# Altium schematic sheet Wombat.SchDoc
size A4; SheetNumber: 1; SheetTotal: 1
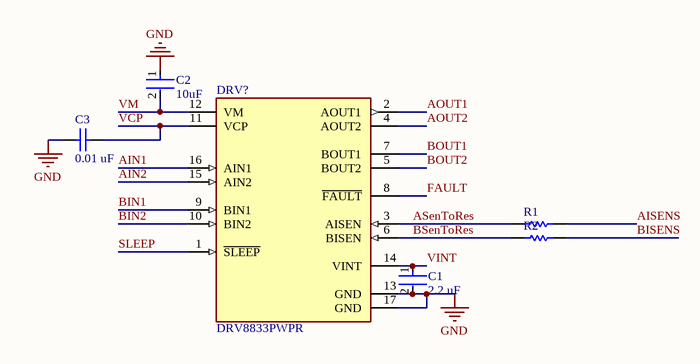
[diagram p0: Wombat.SchDoc]

## Parts
C1  2.2 uF  [FP-GRM188-0_1-e0_2_0_5-MFG]
C2  10uF  [FP-GRM188-0_1-e0_2_0_55-IPC_A]
C3  0.01 uF  [CAPC1608X90X35ML10T15]
DRV?  DRV8833PWPR  [FP-PWP0016C-IPC_B]
R1  (no value)  [RESC1609X50X30NL10T20]
R2  (no value)  [RESC1609X50X30NL10T20]

## Nets
GND: C1.2 C2.1 C3.1 DRV?.13(GND) DRV?.17(GND)
AIN1: DRV?.16(AIN1)
AIN2: DRV?.15(AIN2)
AISENS: R1.2
AOUT1: DRV?.2(AOUT1)
AOUT2: DRV?.4(AOUT2)
ASenToRes: DRV?.3(AISEN) R1.1
BIN1: DRV?.9(BIN1)
BIN2: DRV?.10(BIN2)
BISENS: R2.2
BOUT1: DRV?.7(BOUT1)
BOUT2: DRV?.5(BOUT2)
BSenToRes: DRV?.6(BISEN) R2.1
FAULT: DRV?.8(~{FAULT})
SLEEP: DRV?.1(~{SLEEP})
VCP: C3.2 DRV?.11(VCP)
VINT: C1.1 DRV?.14(VINT)
VM: C2.2 DRV?.12(VM)

## Library data of the parts
C1 = CMP-2006-02836-2: Chip Multilayer Ceramic Capacitors for General Purpose, 0603, 2.2uF, X7R, 15%, 10%, 10V; Case Code (Metric): 1608; Height: 0.8mm; Packaging: Cut Tape; Voltage: 10V; Lead Free: Lead Free; Min Operating Temperature: -55°C; Voltage Rating (DC): 10V; Max Operating Temperature: 125°C; Voltage Rating: 10V; Dielectric: X7R; Depth: 0.8mm; Case Code (Imperial): 0603; Termination: SMD/SMT; Case/Package: 0603; Number of Pins: 2; REACH SVHC: No SVHC; Mount: Surface Mount; Width: 0.031inch; Material: Ceramic; Capacitance: 2.2uF; Package Quantity: 1; Weight: 7.1E-05oz; Length: 1.6mm; Thickness: 0.035inch; Tolerance: 10%
C2 = CMP-2006-02792-2: Chip Multilayer Ceramic Capacitors for General Purpose, 0603, 10uF, X5R, 15%, 20%, 6.3V; Packaging: Tape and Reel; Voltage Rating (DC): 6.3V; Width: 0.031inch; Termination: SMD/SMT; Dielectric: X5R; Package Quantity: 4000; Voltage Rating: 6.3V; Capacitance: 10uF; Case/Package: 0603; Min Operating Temperature: -55°C; Voltage: 6.3V; Length: 1.6mm; Thickness: 0.035inch; Lead Free: Lead Free; Depth: 0.8mm; Case Code (Imperial): 0603; Max Operating Temperature: 85°C; Material: Ceramic; Height: 0.8mm; Tolerance: 20%; Mount: Surface Mount; REACH SVHC: No SVHC; Radiation Hardening: No; Case Code (Metric): 1608
C3 = CMP-2100-03642-1: Chip Capacitor, 10 nF, +/- 10%, 50 V, -55 to 125 degC, 0603 (1608 Metric), RoHS, Tape and Reel; Manufacturer: Murata; Insulation Resistance: 10GR; Dielectric: X7R; Voltage Rating: 50V; Capacitance: 10nF; Material: Ceramic; Package Quantity: 1; Lead Free: LeadFree; Case/Package: 0603; Termination: SMD/SMT; REACH SVHC: Unknown; Manufacturer URL: http://www.murata.com/; Datasheet URL: http://search.murata.co.jp/Ceramy/image/img/A01X/G101/ENG/GRM188R71H103KA01-01.pdf; Mount: SurfaceMount; Datasheet Version: 42401.0; Number of Pins: 2; Length: 1.6mm; Voltage: 50V; Depth: 0.8mm; Tolerance: 10%; Min Operating Temperature: -55degC; Voltage Rating (DC): 50V; Max Operating Temperature: 125degC; Package Description: 2-Pin Surface Mount Device, Body 1.6 x 0.8 mm; RoHSCompliant: True; Case Code (Imperial): 0603; Width: 0.031inch; Case Code (Metric): 1608; Height: 0.8mm; Package Reference: 0603; Packaging: TapeandReel; Thickness: 0.035inch; Dielectric Material: Ceramic
DRV? = CMP-1529-00004-3: IC MOTOR DRIVER PAR 16HTSSOP; Supply Current: 3mA; Max Output Current: 2A; Interface: PWM; Output Current: 1.5A; Max Supply Voltage: 10.8V; Fault Protection: Over Temperature; Number of Outputs: 2; Min Supply Voltage: 2.7V; Nominal Supply Current: 3mA; Series: DRV8833; Min Operating Temperature: -40°C; Package Quantity: 2000; Packaging: Tape and Reel; Case/Package: HTSSOP; Output Current per Channel: 1.5A; RoHS Compliant: Yes; RMS Current (Irms): 1.5A; Max Operating Temperature: 85°C; Technology: NMOS; Number of Pins: 16; Radiation Hardening: No; Lead Free: Lead Free; REACH SVHC: No SVHC
R1 R2 = CMP-1012-00171-2: Manufacturer: Vishay Dale; Part Number: CRCW06031R00FKEA